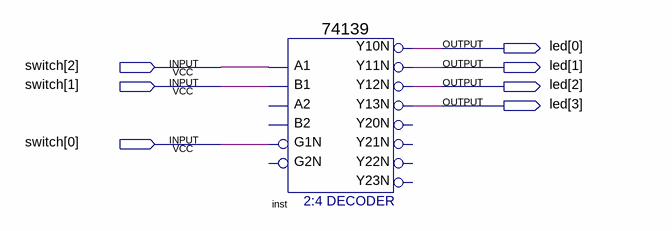
[diagram p0: schematic sheet]
// Quartus schematic pj401.bdf as structural Verilog: 1 symbols, 7 pins
module pj401 (
  input  [2:0] switch,
  output [3:0] led
);

  \74139  inst (
    .A1(switch[2]), .B1(switch[1]), .G1N(switch[0]), .Y10N(led[0]), .Y13N(led[3]), .Y12N(led[2]),
    .Y11N(led[1]));  // open: A2, B2, G2N, Y20N, Y21N, Y22N, Y23N
endmodule
